# Altium schematic sheet Docking.SchDoc
size A
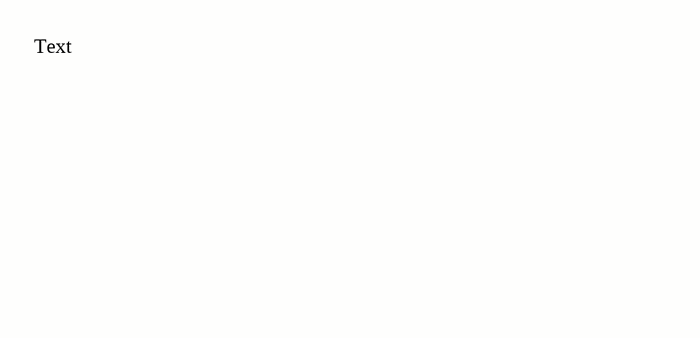
[diagram p0: Docking.SchDoc]

## Notes on the sheet
- Text